# Altium schematic sheet Inverter_TOP_LEVEL.SchDoc
size A3; SheetNumber: 1; SheetTotal: 5
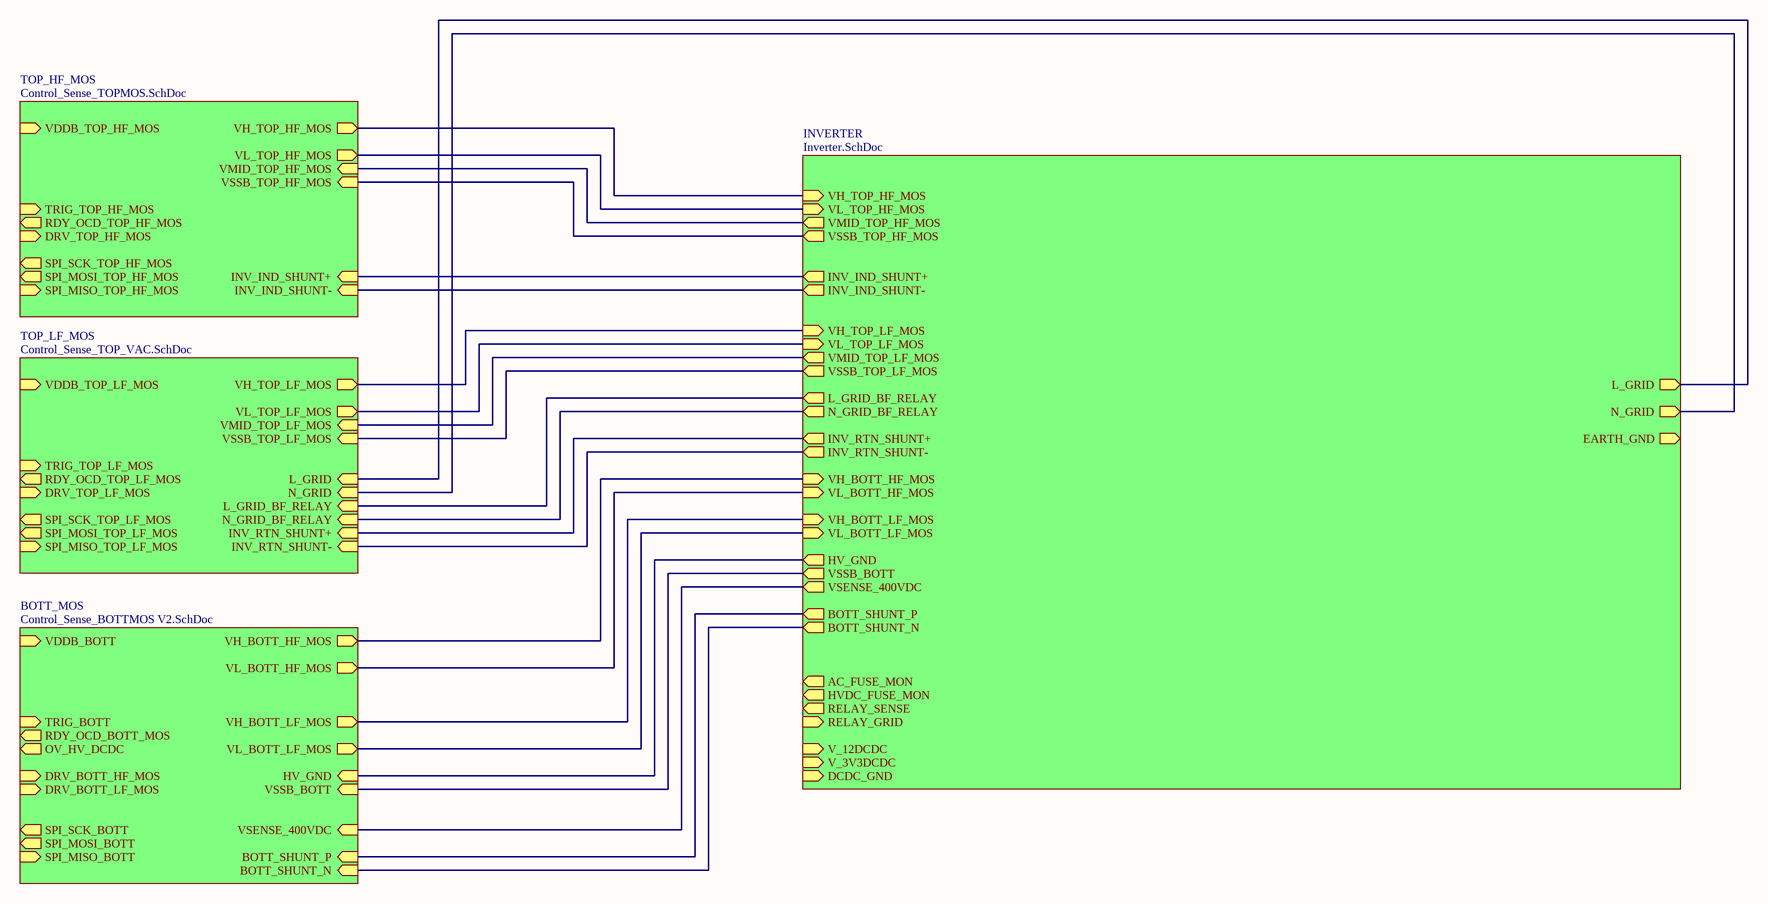
[diagram p0: Inverter_TOP_LEVEL.SchDoc]

## Sub-sheets
BOTT_MOS = Control_Sense_BOTTMOS V2.SchDoc: DRV_BOTT_LF_MOS (in), VDDB_BOTT (in), HV_GND (in), DRV_BOTT_HF_MOS (in), RDY_OCD_BOTT_MOS (out), OV_HV_DCDC (out), TRIG_BOTT (in), SPI_SCK_BOTT (out), SPI_MISO_BOTT (in), SPI_MOSI_BOTT (out), BOTT_SHUNT_P (in), VSENSE_400VDC (in), VSSB_BOTT (in), VH_BOTT_LF_MOS (out), VL_BOTT_HF_MOS (out), VL_BOTT_LF_MOS (out), VH_BOTT_HF_MOS (out), BOTT_SHUNT_N (in)
INVERTER = Inverter.SchDoc: BOTT_SHUNT_N (out), BOTT_SHUNT_P (out), VMID_TOP_HF_MOS (out), VMID_TOP_LF_MOS (out), INV_IND_SHUNT- (out), VSSB_TOP_HF_MOS (out), INV_IND_SHUNT+ (out), VSSB_BOTT (out), RELAY_GRID (in), RELAY_SENSE (out), EARTH_GND (out), VH_BOTT_HF_MOS (in), L_GRID (out), DCDC_GND (in), V_12DCDC (in), VH_TOP_HF_MOS (in), INV_RTN_SHUNT+ (out), VL_TOP_LF_MOS (in), HV_GND (out), VH_BOTT_LF_MOS (in), INV_RTN_SHUNT- (out), VL_TOP_HF_MOS (in), N_GRID (out), VSENSE_400VDC (out), VL_BOTT_HF_MOS (in), VH_TOP_LF_MOS (in), VL_BOTT_LF_MOS (in), VSSB_TOP_LF_MOS (out), AC_FUSE_MON (out), HVDC_FUSE_MON (out), V_3V3DCDC (in), L_GRID_BF_RELAY (out), N_GRID_BF_RELAY (out)
TOP_HF_MOS = Control_Sense_TOPMOS.SchDoc: TRIG_TOP_HF_MOS (in), SPI_SCK_TOP_HF_MOS (out), VH_TOP_HF_MOS (out), INV_IND_SHUNT+ (in), DRV_TOP_HF_MOS (in), VMID_TOP_HF_MOS (in), VL_TOP_HF_MOS (out), SPI_MOSI_TOP_HF_MOS (out), SPI_MISO_TOP_HF_MOS (in), INV_IND_SHUNT- (in), VDDB_TOP_HF_MOS (in), VSSB_TOP_HF_MOS (in), RDY_OCD_TOP_HF_MOS (out)
TOP_LF_MOS = Control_Sense_TOP_VAC.SchDoc: VH_TOP_LF_MOS (out), TRIG_TOP_LF_MOS (in), VMID_TOP_LF_MOS (in), VSSB_TOP_LF_MOS (in), N_GRID (in), INV_RTN_SHUNT+ (in), SPI_SCK_TOP_LF_MOS (out), SPI_MISO_TOP_LF_MOS (in), L_GRID (in), DRV_TOP_LF_MOS (in), SPI_MOSI_TOP_LF_MOS (out), VL_TOP_LF_MOS (out), INV_RTN_SHUNT- (in), VDDB_TOP_LF_MOS (in), RDY_OCD_TOP_LF_MOS (out), N_GRID_BF_RELAY (in), L_GRID_BF_RELAY (in)

## Nets
(unnamed): sheet TOP_HF_MOS/VH_TOP_HF_MOS, sheet INVERTER/VH_TOP_HF_MOS
(unnamed): sheet TOP_HF_MOS/INV_IND_SHUNT+, sheet INVERTER/INV_IND_SHUNT+
(unnamed): sheet TOP_HF_MOS/VMID_TOP_HF_MOS, sheet INVERTER/VMID_TOP_HF_MOS
(unnamed): sheet TOP_HF_MOS/VL_TOP_HF_MOS, sheet INVERTER/VL_TOP_HF_MOS
(unnamed): sheet TOP_HF_MOS/INV_IND_SHUNT-, sheet INVERTER/INV_IND_SHUNT-
(unnamed): sheet TOP_HF_MOS/VSSB_TOP_HF_MOS, sheet INVERTER/VSSB_TOP_HF_MOS
(unnamed): sheet TOP_LF_MOS/VH_TOP_LF_MOS, sheet INVERTER/VH_TOP_LF_MOS
(unnamed): sheet TOP_LF_MOS/VMID_TOP_LF_MOS, sheet INVERTER/VMID_TOP_LF_MOS
(unnamed): sheet TOP_LF_MOS/VSSB_TOP_LF_MOS, sheet INVERTER/VSSB_TOP_LF_MOS
(unnamed): sheet TOP_LF_MOS/N_GRID, sheet INVERTER/N_GRID
(unnamed): sheet TOP_LF_MOS/INV_RTN_SHUNT+, sheet INVERTER/INV_RTN_SHUNT+
(unnamed): sheet TOP_LF_MOS/L_GRID, sheet INVERTER/L_GRID
(unnamed): sheet TOP_LF_MOS/VL_TOP_LF_MOS, sheet INVERTER/VL_TOP_LF_MOS
(unnamed): sheet TOP_LF_MOS/INV_RTN_SHUNT-, sheet INVERTER/INV_RTN_SHUNT-
(unnamed): sheet TOP_LF_MOS/N_GRID_BF_RELAY, sheet INVERTER/N_GRID_BF_RELAY
(unnamed): sheet TOP_LF_MOS/L_GRID_BF_RELAY, sheet INVERTER/L_GRID_BF_RELAY
(unnamed): sheet BOTT_MOS/HV_GND, sheet INVERTER/HV_GND
(unnamed): sheet BOTT_MOS/BOTT_SHUNT_P, sheet INVERTER/BOTT_SHUNT_P
(unnamed): sheet BOTT_MOS/VSENSE_400VDC, sheet INVERTER/VSENSE_400VDC
(unnamed): sheet BOTT_MOS/VSSB_BOTT, sheet INVERTER/VSSB_BOTT
(unnamed): sheet BOTT_MOS/VH_BOTT_LF_MOS, sheet INVERTER/VH_BOTT_LF_MOS
(unnamed): sheet BOTT_MOS/VL_BOTT_HF_MOS, sheet INVERTER/VL_BOTT_HF_MOS
(unnamed): sheet BOTT_MOS/VL_BOTT_LF_MOS, sheet INVERTER/VL_BOTT_LF_MOS
(unnamed): sheet BOTT_MOS/VH_BOTT_HF_MOS, sheet INVERTER/VH_BOTT_HF_MOS
(unnamed): sheet BOTT_MOS/BOTT_SHUNT_N, sheet INVERTER/BOTT_SHUNT_N